# Altium schematic sheet Miscellaneous.SchDoc
size Tabloid; DrawnBy: Krutav Shah; SheetNumber: 4; SheetTotal: 6
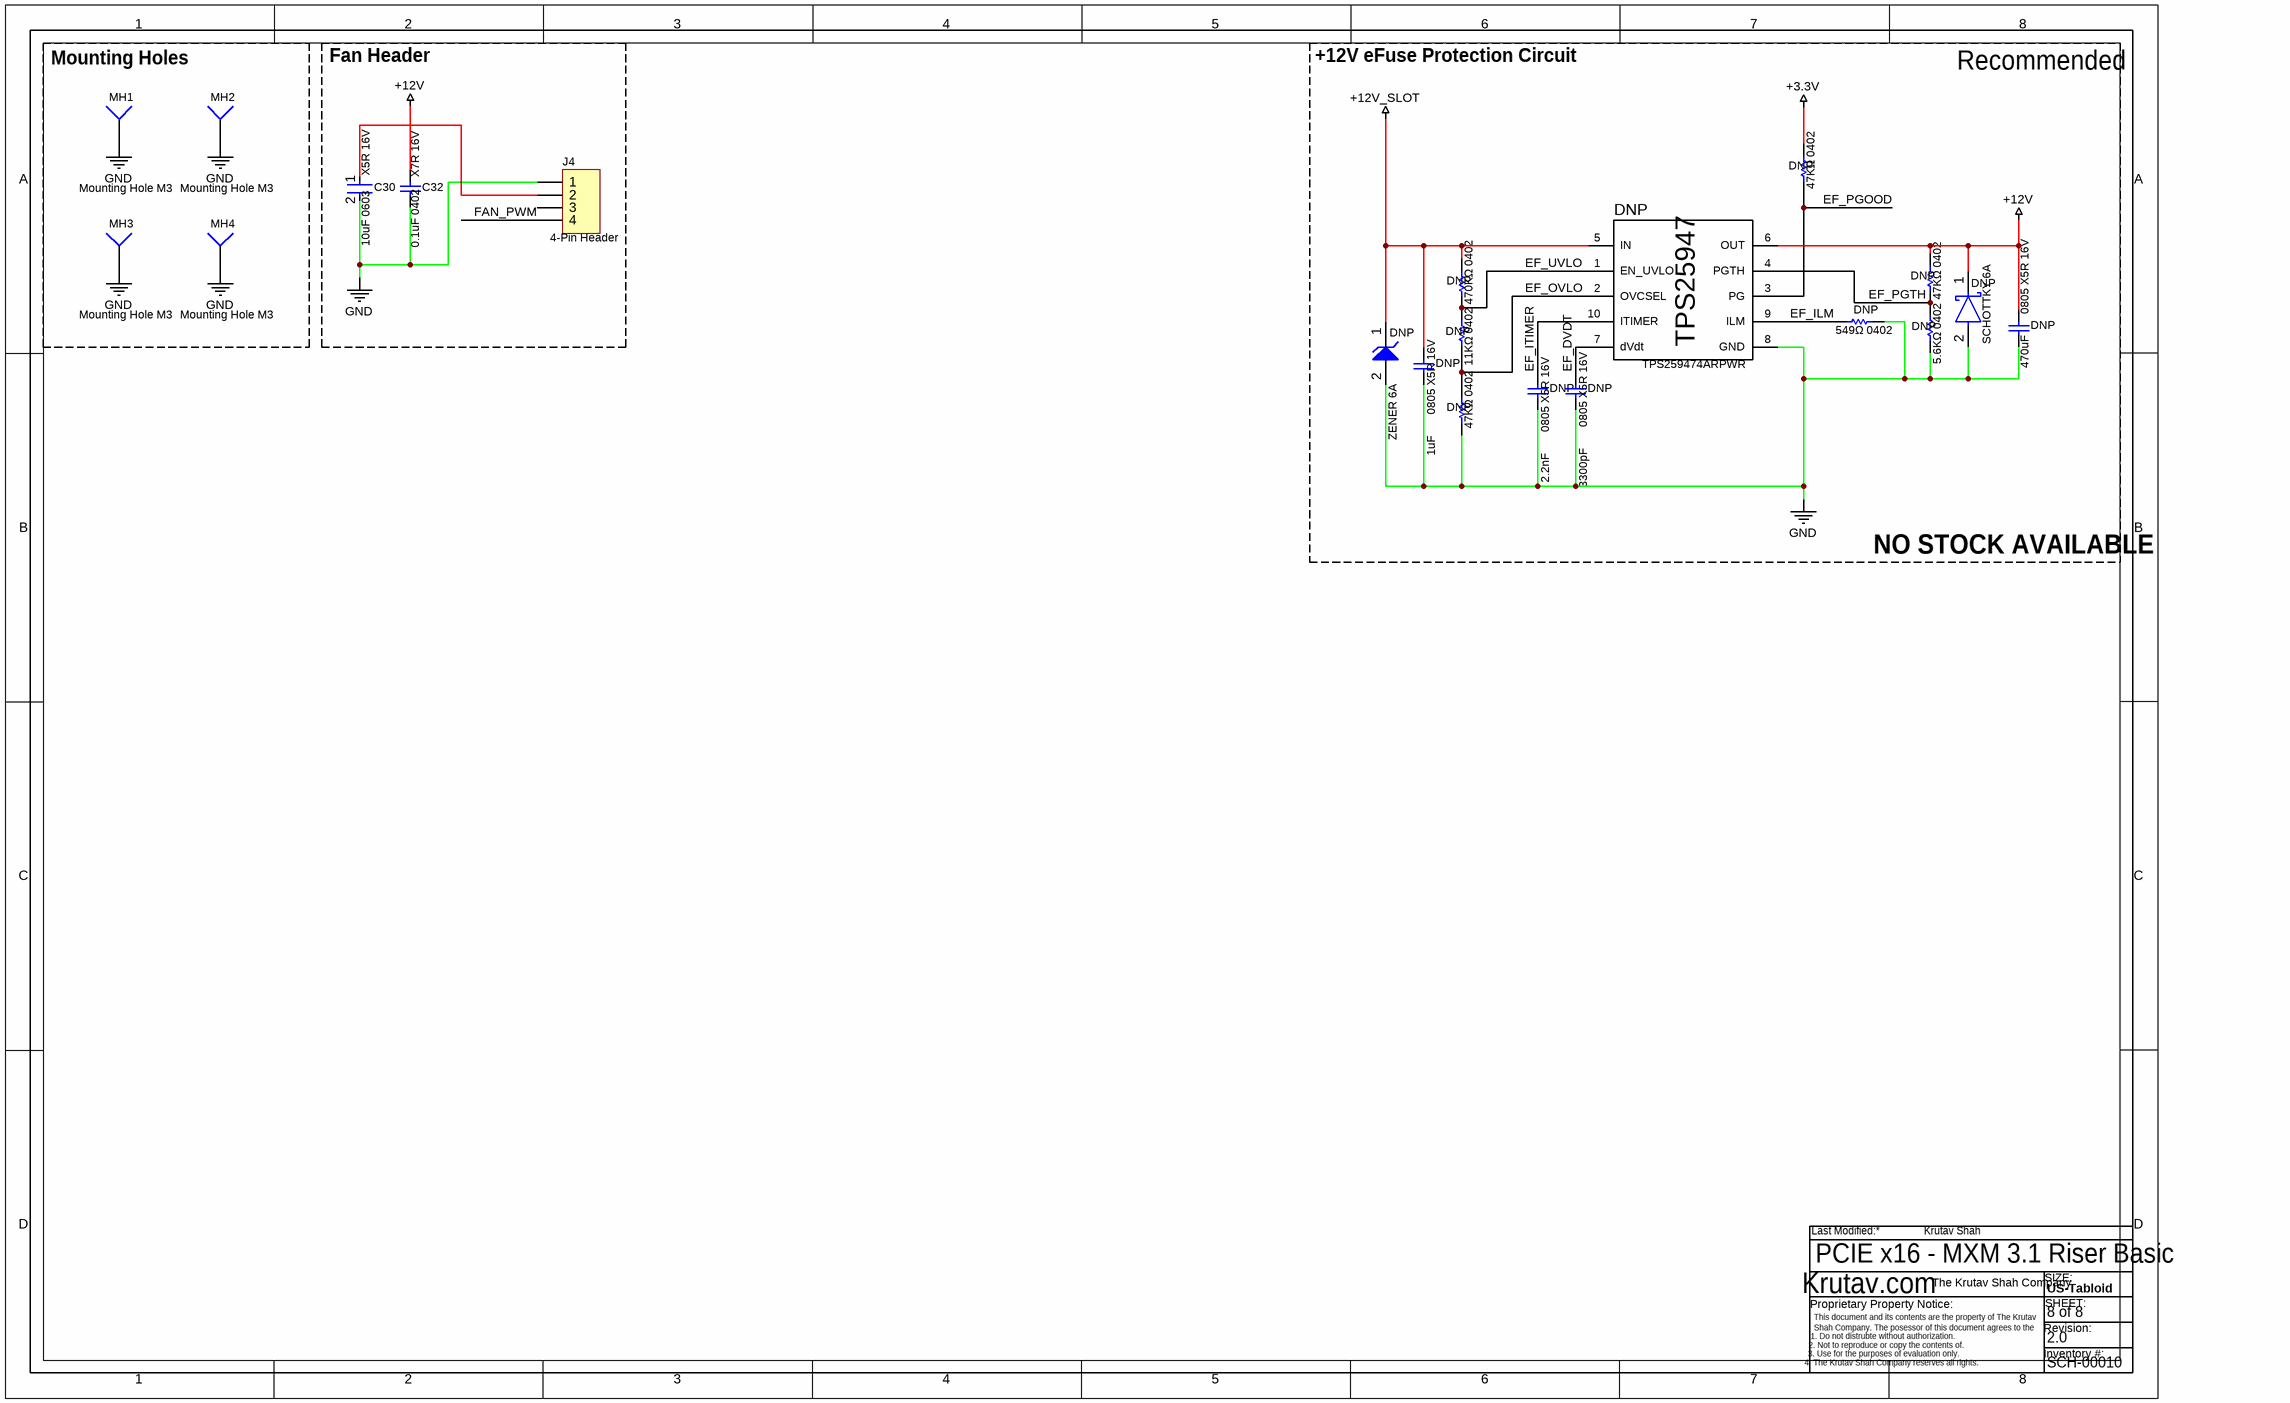
[diagram p0: Miscellaneous.SchDoc]

## Parts
(Parts that share a designator on the sheet are numbered #1, #2 ... from top to bottom, then left to right.)
C30  10uF 0603     X5R 16V  [FP-CL21-IPC_A]
C32  0.1uF 0402    X7R 16V  [CAPC1050X55X23ML05T13]
DNP#1  47KΩ 0402  [RESC0201(0603)_L]  (no BOM)
DNP#2  TPS259474ARPWR  [RPW0010A-MFG]  (no BOM)
DNP#3  47KΩ 0402  [RESC0201(0603)_L]  (no BOM)
DNP#4  470KΩ 0402  [RESC0201(0603)_L]  (no BOM)
DNP#5  470uF       0805 X5R 16V  [CAPC0603X33X15NL03T05]  (no BOM)
DNP#6  549Ω 0402  [RESC0201(0603)_L]  (no BOM)
DNP#7  5.6KΩ 0402  [RESC0201(0603)_L]  (no BOM)
DNP#8  ZENER 6A  [ONSC-SOD-123-2-425-04_V]  (no BOM)
DNP#9  11KΩ 0402  [RESC0201(0603)_L]  (no BOM)
DNP#10  SCHOTTKY 6A  [FP-425-04-IPC_B]  (no BOM)
DNP#11  1uF       0805 X5R 16V  [CAPC0603X33X15NL03T05]  (no BOM)
DNP#12  2.2nF       0805 X5R 16V  [CAPC0603X33X15NL03T05]  (no BOM)
DNP#13  3300pF       0805 X5R 16V  [CAPC0603X33X15NL03T05]  (no BOM)
DNP#14  47KΩ 0402  [RESC0201(0603)_L]  (no BOM)
J4  4-Pin Header  [HDR1X4]
MH1  Mounting Hole M3  [PIN1]  (mechanical)
MH2  Mounting Hole M3  [PIN1]  (mechanical)
MH3  Mounting Hole M3  [PIN1]  (mechanical)
MH4  Mounting Hole M3  [PIN1]  (mechanical)

## Blocks framed on the sheet
Mounting Holes: MH1-MH4
Fan Header: C30 C32 J4

## Nets
+3.3V: DNP#1.1
+12V: C32.2 DNP#2.6(OUT) DNP#3.1 DNP#5.1 DNP#10.1(C)
+12V_SLOT: DNP#2.5(IN) DNP#4.1 DNP#8.1(K) DNP#11.1
GND: C30.2 C32.1 DNP#2.8(GND) DNP#5.2 DNP#6.1 DNP#7.1 DNP#8.2(A) DNP#10.2(A) DNP#11.2 DNP#12.2 DNP#13.2 DNP#14.2 J4.1 MH1.1 MH2.1 MH3.1 MH4.1
EF_DVDT: DNP#2.7(dVdt) DNP#13.1
EF_ILM: DNP#2.9(ILM) DNP#6.2
EF_ITIMER: DNP#2.10(ITIMER) DNP#12.1
EF_OVLO: DNP#2.2(OVCSEL) DNP#9.1 DNP#14.1
EF_PGOOD: DNP#1.2 DNP#2.3(PG)
EF_PGTH: DNP#2.4(PGTH) DNP#3.2 DNP#7.2
EF_UVLO: DNP#2.1(EN_UVLO) DNP#4.2 DNP#9.2
FAN_PWM: J4.4
NetC30_1: C30.1 J4.2

Not connected (* = marked no-connect by the designer): J4 3

## Notes on the sheet
- +12V eFuse Protection Circuit
- Recommended
- NO STOCK AVAILABLE
- PCIE x16 - MXM 3.1 Riser Basic
- 8 of 8
- 2.0
- SCH-00010
- Last Modified:
- Krutav.com
- The Krutav Shah Company
- US-Tabloid
- SIZE:
- SHEET:
- This document and its contents are the property of The Krutav Shah Company. The posessor of this document agrees to the following:
- Proprietary Property Notice:
- 1. Do not distrubte without authorization.
- 3. Use for the purposes of evaluation only.
- 2. Not to reproduce or copy the contents of.
- 4. The Krutav Shah Company reserves all rights.
- Revision:
- Inventory #:
- (in symbol TPS259474ARPWR) TPS25947

## Library data of the parts
C30 = CMP-13271-002624-1: CL21 Series 0805 4.7uF 25V ±10% Tolerance X5R Multilayer Ceramic Chip Capacitor; Case Code (Imperial): 0805; Thickness: 0.055inch; Mount: Surface Mount; Case Code (Metric): 2012; Capacitance: 4.7uF; Depth: 1.25mm; Lead Free: Lead Free; Case/Package: 0805; Voltage Rating: 25V; Package Quantity: 1; Width: 0.049inch; Radiation Hardening: No; Voltage Rating (DC): 25V; Length: 2mm; Dielectric: X5R; Height: 1.25mm; Packaging: Tape and Reel; Tolerance: 10%; Min Operating Temperature: -55°C; Max Operating Temperature: 85°C
C32 = CMP-2000-05439-1: Chip Capacitor, 100 nF, +/- 10%, 16 V, -55 to 125 degC, 0402 (1005 Metric), RoHS, Tape and Reel; Manufacturer: Samsung Electro-Mechanics; Capacitance: 100000pF; Case Size/Dimension: 0402; Tolerance (%): ±10%; Manufacturer URL: http://www.samsungsem.com/global/index.jsp; Dielectric: X7R; Datasheet URL: https://datasheet.ciiva.com/29198/458718-da-01-en-vs-kondensator-0402-29198423.pdf; Rated Voltage: 16V; Datasheet Version: Nov-10
DNP#1 DNP#3 DNP#4 DNP#6 DNP#7 DNP#9 DNP#14 = CMP-1010-00755-1: 1M 0.05W 1% 0201 (0603 Metric)  SMD; Case-Metric: 0603; Value: 1000000.00 Ohm; Case-EIA: 0201; Technology: SMT; Tolerance: 1 %; Power: 0.05 W
DNP#2 = TPS259474ARPWR: No Description Available; Mfr_Name: Texas Instruments; Type: DEV; RefDes: RefDes; Copyright: Copyright (C) 2021 Ultra Librarian. All rights reserved.; Manufacturer_Part_Number: TPS259474ARPWR; Digi-Key_Part_Number_1: 296-TPS259474ARPWRCT-ND; Digi-Key_Part_Number_2: 296-TPS259474ARPWRDKR-ND; Digi-Key_Part_Number_3: 296-TPS259474ARPWRTR-ND
DNP#5 DNP#11-DNP#13 = CMP-2010-00679-1: Manufacturer: Samsung; Part Number: CL03A224MQ3NNNC
DNP#8 = CMP-1060-00606-1: Zener Voltage Regulator, 500 mW, 2-Pin SOD-123, Pb-Free, Tape and Reel; Manufacturer: On Semiconductor; PartNumber: MMSZ4691T1G; VZ Typ (V): 6.2; P Max (W): 0.5; DatasheetVersion: Rev. 9; ComponentLink1Description: Manufacturer URL; PackageReference: SOD-123-2-425-04; RoHS: Pb-Free; Mounting Technology: Surface Mount; ComponentLink3URL: http://www.onsemi.com/pub_link/Collateral/425-04.PDF; Packing: Tape and Reel; ComponentLink2URL: http://www.onsemi.com/pub_link/Collateral/MMSZ4678T1-D.PDF; PackageVersion: Rev. G, 10/2009; ComponentLink1URL: http://www.onsemi.com/; PackageDescription: 2-Pin SOD, Body 1.6 x 2.69 mm; ComponentLink2Description: Datasheet; ComponentLink3Description: Package Specification
DNP#10 = CMP-1055-00425-2: DIODE SCHOTTKY 20V 500MA SOD123; Polarity: Standard; Peak Non-Repetitive Surge Current: 5.5A; Forward Voltage: 385mV; Element Configuration: Single; Peak Reverse Current: 250uA; Max Repetitive Reverse Voltage (Vrrm): 20V; Voltage Rating (DC): 20V; Case/Package: SOD-123-2; Number of Pins: 2; Output Current: 500mA; Min Operating Temperature: -65°C; Lead Free: Lead Free; REACH SVHC: No SVHC; Max Reverse Voltage (DC): 20V; Termination: SMD/SMT; Average Rectified Current: 500mA; Max Surge Current: 5.5A; Package Quantity: 3000; Height: 1.12mm; Current Rating: 500mA; Forward Current: 500mA; Max Forward Surge Current (Ifsm): 5.5A; Packaging: Tape and Reel; Length: 2.69mm; Radiation Hardening: No; Max Reverse Leakage Current: 250uA; Width: 1.6mm; Contact Plating: Tin; Max Operating Temperature: 125°C
J4 = Header 4: Header, 4-Pin; LatestRevisionDate: 17-Jul-2002; LatestRevisionNote: Re-released for DXP Platform.; Publisher: Altium Limited
MH1 MH2 = Socket: Mounting Hole, 6mm diameter, 3.2mm hole diameter.; LatestRevisionDate: 17-Jul-2002; LatestRevisionNote: Re-released for DXP Platform.; Publisher: Altium Limited
MH3 MH4 = Socket: Mounting Hole, 6x4mm, 3.2mm hole diameter.; LatestRevisionDate: 17-Jul-2002; LatestRevisionNote: Re-released for DXP Platform.; Publisher: Altium Limited